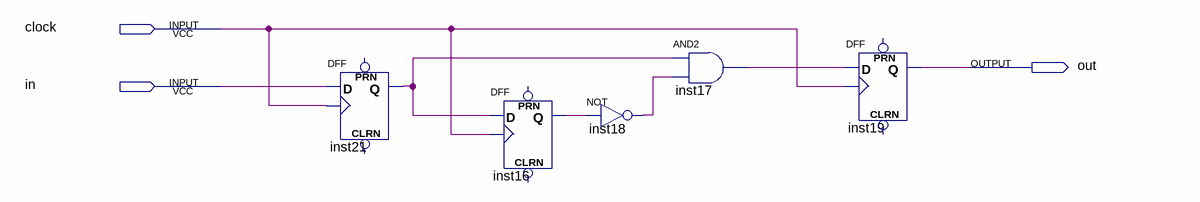
[diagram p0: schematic sheet]
// Quartus schematic edgepos.bdf as structural Verilog: 5 symbols, 3 pins
module edgepos (
  input  clock,
  input  in,
  output out
);

  wire inst16_q, inst17_out, inst18_out, inst21_q;

  DFF inst21 (.CLK(clock), .D(in), .Q(inst21_q));  // open: CLRN, PRN
  DFF inst16 (.CLK(clock), .D(inst21_q), .Q(inst16_q));  // open: CLRN, PRN
  not inst18 (inst18_out, inst16_q);
  and inst17 (inst17_out, inst21_q, inst18_out);
  DFF inst19 (.CLK(clock), .D(inst17_out), .Q(out));  // open: CLRN, PRN
endmodule
